# EAGLE design singleboard (EAGLE 7.2.0)
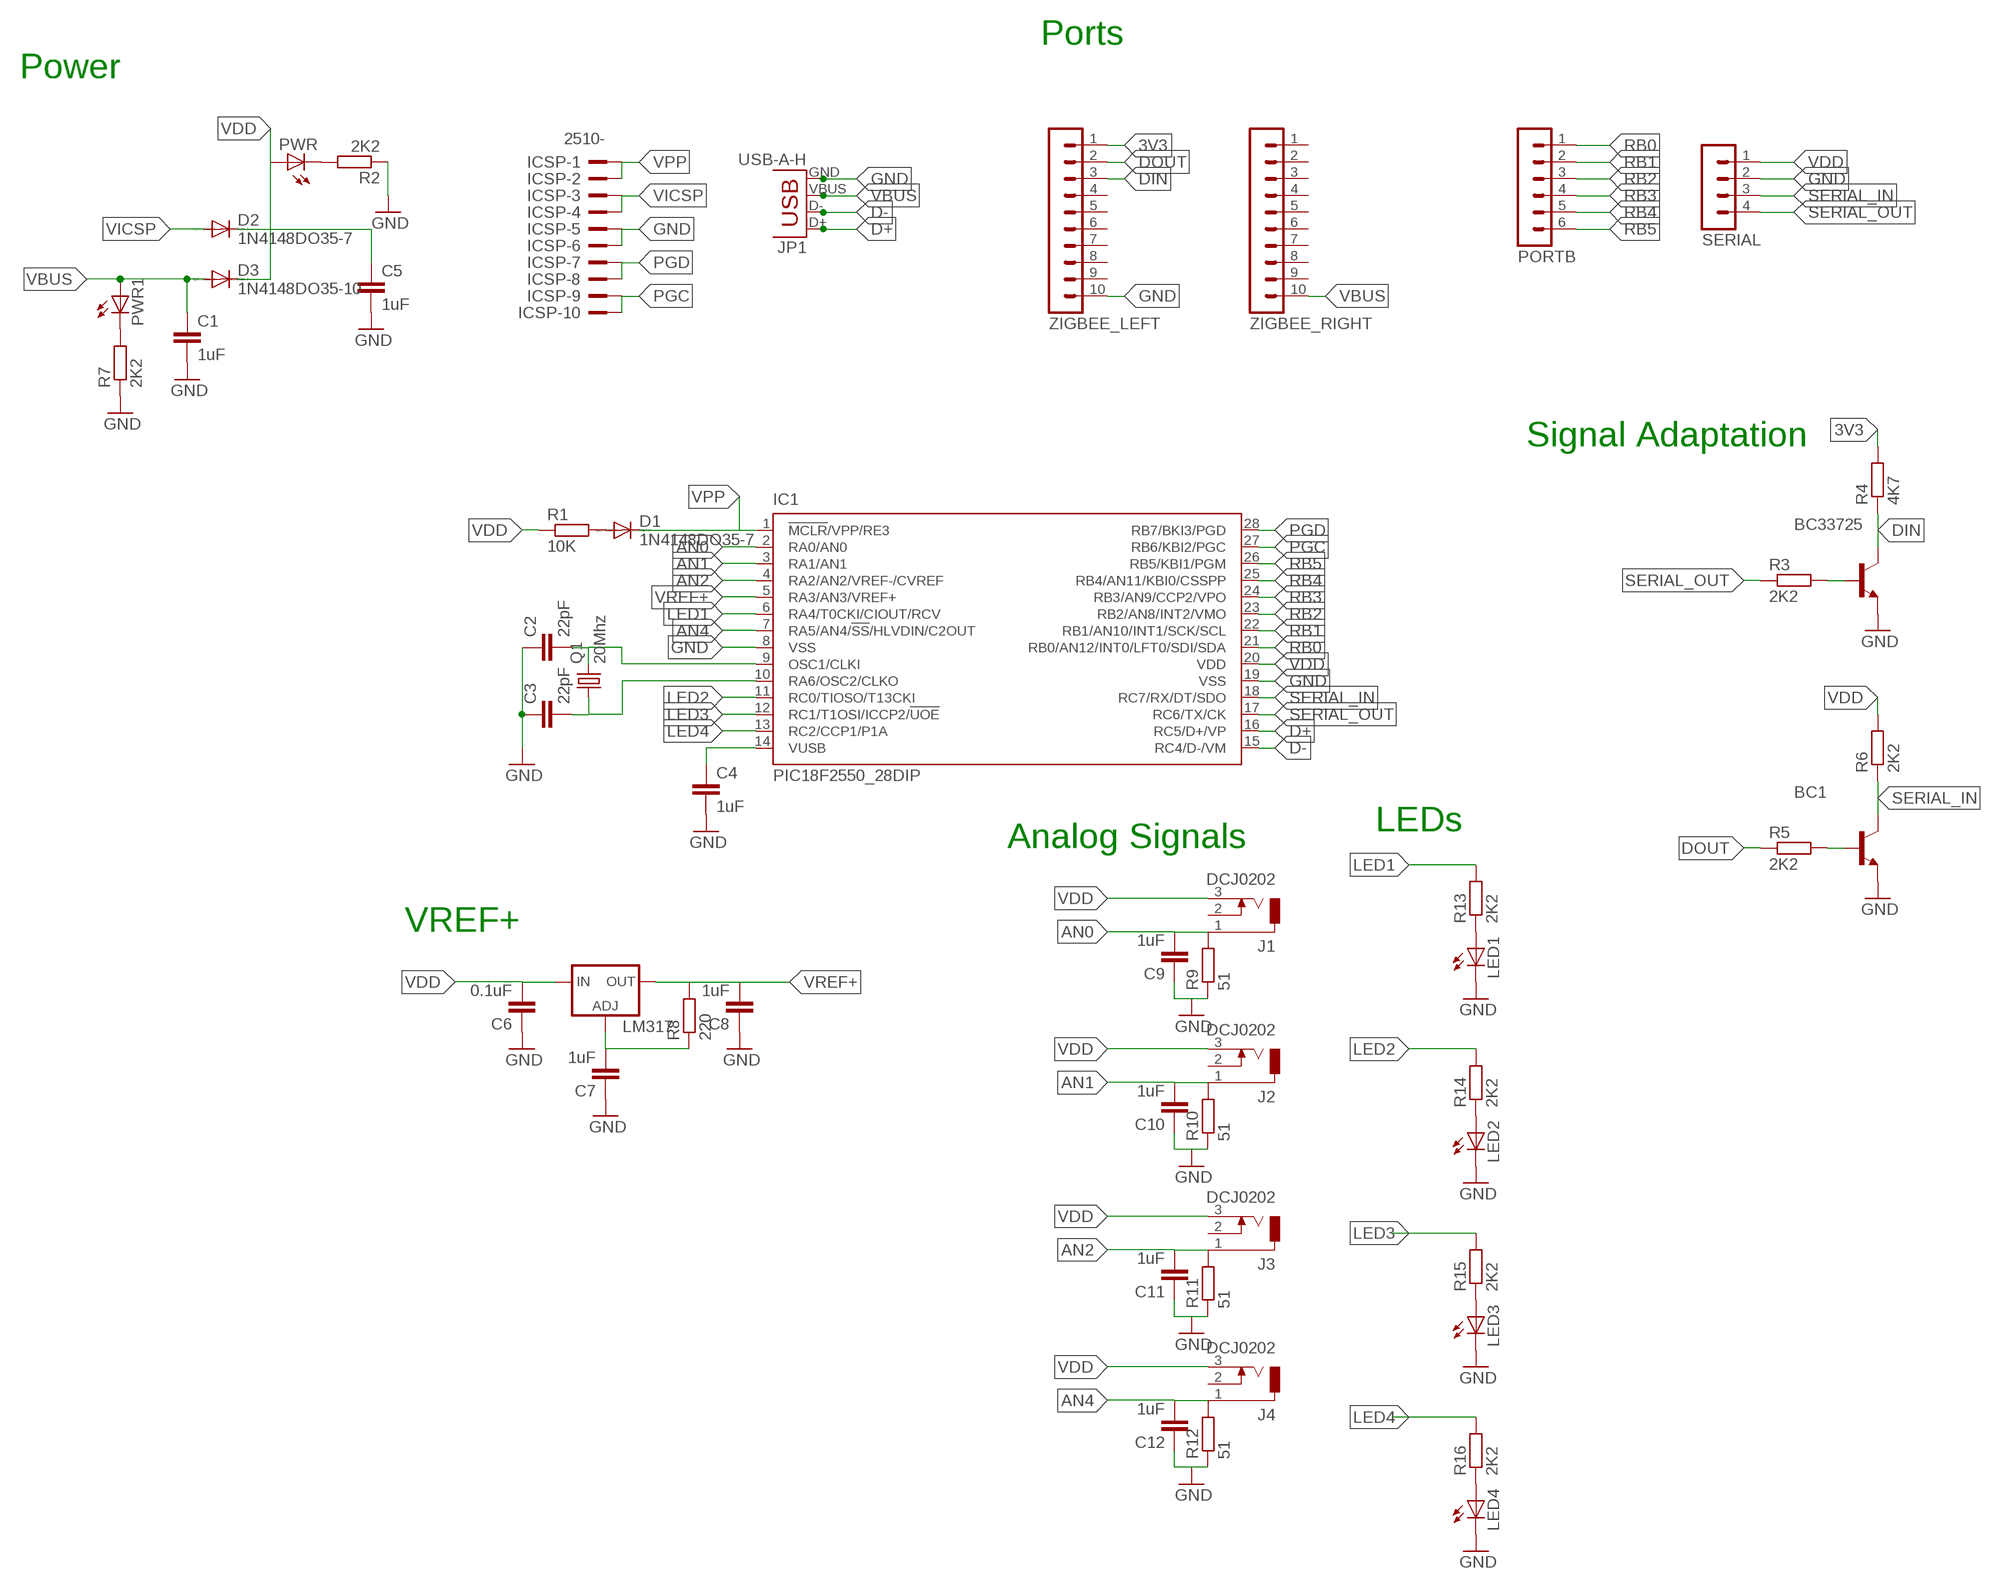
[diagram p0: schematic, sheet 1]

## Parts
BC1  BC337-25-NPN-TO92-CBE  [TO92-CBE]
BC33725  BC337-25-NPN-TO92-CBE  [TO92-CBE]
C1  1uF  C-EU050-025X075  [C050-025X075]
C2  22pF  C-EU025-024X044  [C025-024X044]
C3  22pF  C-EU025-024X044  [C025-024X044]
C4  1uF  C-EU025-024X044  [C025-024X044]
C5  1uF  C-EU025-024X044  [C025-024X044]
C6  0.1uF  C-EU050-025X075  [C050-025X075]
C7  1uF  C-EU050-025X075  [C050-025X075]
C8  1uF  C-EU050-025X075  [C050-025X075]
C9  1uF  C-EU050-025X075  [C050-025X075]
C10  1uF  C-EU050-025X075  [C050-025X075]
C11  1uF  C-EU050-025X075  [C050-025X075]
C12  1uF  C-EU050-025X075  [C050-025X075]
D1  1N4148DO35-7  [DO35-7]
D2  1N4148DO35-7  [DO35-7]
D3  1N4148DO35-10  [DO35-10]
IC1  PIC18F2550_28DIP  [DIL28-3]
ICSP  2510-  [PAK100/2500-10]
J1  DCJ0202  [DCJ0202]
J2  DCJ0202  [DCJ0202]
J3  DCJ0202  [DCJ0202]
J4  DCJ0202  [DCJ0202]
JP1  USB-A-H  [USB-A-H]
LED1  LED3MM  [LED3MM]
LED2  LED3MM  [LED3MM]
LED3  LED3MM  [LED3MM]
LED4  LED3MM  [LED3MM]
LM317  LM317TS  [317TS]
PORTB  MA06-1  [MA06-1]
PWR  LED3MM  [LED3MM]
PWR1  LED3MM  [LED3MM]
Q1  20Mhz  CRYSTALHC49S  [HC49/S]
R1  10K  R-EU_0204/7  [0204/7]
R2  2K2  R-EU_0204/5  [0204/5]
R3  2K2  R-EU_0204/5  [0204/5]
R4  4K7  R-EU_0204/5  [0204/5]
R5  2K2  R-EU_0204/5  [0204/5]
R6  2K2  R-EU_0204/5  [0204/5]
R7  2K2  R-EU_0204/5  [0204/5]
R8  220  R-EU_0204/5  [0204/5]
R9  51  R-EU_0204/5  [0204/5]
R10  51  R-EU_0204/5  [0204/5]
R11  51  R-EU_0204/5  [0204/5]
R12  51  R-EU_0204/5  [0204/5]
R13  2K2  R-EU_0204/5  [0204/5]
R14  2K2  R-EU_0204/5  [0204/5]
R15  2K2  R-EU_0204/5  [0204/5]
R16  2K2  R-EU_0204/5  [0204/5]
SERIAL  MA04-1  [MA04-1]
ZIGBEE_LEFT  MA10-1  [MA10-1]
ZIGBEE_RIGHT  MA10-1  [MA10-1]

## Nets
3V3: R4.2 ZIGBEE_LEFT.1
AN0: C9.2 IC1.2(RA0/AN0) J1.1 R9.2
AN1: C10.2 IC1.3(RA1/AN1) J2.1 R10.2
AN2: C11.2 IC1.4(RA2/AN2/VREF-/CVREF) J3.1 R11.2
AN4: C12.2 IC1.7(RA5/AN4/!SS!/HLVDIN/C2OUT) J4.1 R12.2
D+: IC1.16(RC5/D+/VP) JP1.D+
D-: IC1.15(RC4/D-/VM) JP1.D-
DIN: BC33725.C R4.1 ZIGBEE_LEFT.3
DOUT: R5.1 ZIGBEE_LEFT.2
GND: BC1.E BC33725.E C1.2 C2.1 C3.1 C4.2 C5.2 C6.1 C7.1 C8.1 C9.1 C10.1 C11.1 C12.1 IC1.8(VSS) IC1.19(VSS) ICSP.5 ICSP.6 JP1.GND LED1.K(C) LED2.K(C) LED3.K(C) LED4.K(C) R2.1 R7.1 R9.1 R10.1 R11.1 R12.1 SERIAL.2 ZIGBEE_LEFT.10
LED1: IC1.6(RA4/T0CKI/CIOUT/RCV) R13.2
LED2: IC1.11(RC0/TIOSO/T13CKI) R14.2
LED3: IC1.12(RC1/T1OSI/ICCP2/!UOE) R15.2
LED4: IC1.13(RC2/CCP1/P1A) R16.2
N$1: C3.2 IC1.10(RA6/OSC2/CLKO) Q1.1
N$2: D1.A R1.2
N$3: C4.1 IC1.14(VUSB)
N$4: C2.2 IC1.9(OSC1/CLKI) Q1.2
N$5: PWR.K(C) R2.2
N$6: BC33725.B R3.2
N$7: BC1.B R5.2
N$8: PWR1.K(C) R7.2
N$9: C7.2 LM317.1(ADJ) R8.1
N$10: LED1.A R13.1
N$11: LED2.A R14.1
N$12: LED3.A R15.1
N$13: LED4.A R16.1
PGC: IC1.27(RB6/KBI2/PGC) ICSP.9 ICSP.10
PGD: IC1.28(RB7/BKI3/PGD) ICSP.7 ICSP.8
RB0: IC1.21(RB0/AN12/INT0/LFT0/SDI/SDA) PORTB.1
RB1: IC1.22(RB1/AN10/INT1/SCK/SCL) PORTB.2
RB2: IC1.23(RB2/AN8/INT2/VMO) PORTB.3
RB3: IC1.24(RB3/AN9/CCP2/VPO) PORTB.4
RB4: IC1.25(RB4/AN11/KBI0/CSSPP) PORTB.5
RB5: IC1.26(RB5/KBI1/PGM) PORTB.6
SERIAL_IN: BC1.C IC1.18(RC7/RX/DT/SDO) R6.1 SERIAL.3
SERIAL_OUT: IC1.17(RC6/TX/CK) R3.1 SERIAL.4
VBUS: C1.1 D3.A JP1.VBUS PWR1.A ZIGBEE_RIGHT.10
VDD: C5.1 C6.2 D2.C D3.C IC1.20(VDD) J1.3 J2.3 J3.3 J4.3 LM317.3(IN) PWR.A R1.1 R6.2 SERIAL.1
VICSP: D2.A ICSP.3 ICSP.4
VPP: D1.C IC1.1(!MCLR!/VPP/RE3) ICSP.1 ICSP.2
VREF+: C8.2 IC1.5(RA3/AN3/VREF+) LM317.2(OUT) R8.2
Unconnected: J1.2 J2.2 J3.2 J4.2 ZIGBEE_LEFT.4 ZIGBEE_LEFT.5 ZIGBEE_LEFT.6 ZIGBEE_LEFT.7 ZIGBEE_LEFT.8 ZIGBEE_LEFT.9 ZIGBEE_RIGHT.1 ZIGBEE_RIGHT.2 ZIGBEE_RIGHT.3 ZIGBEE_RIGHT.4 ZIGBEE_RIGHT.5 ZIGBEE_RIGHT.6 ZIGBEE_RIGHT.7 ZIGBEE_RIGHT.8 ZIGBEE_RIGHT.9

## Notes on the sheet
- Ports
- Power
- Signal Adaptation
- LEDs
- Analog Signals
- VREF+

## Library data of the parts
BC1 BC33725 = transistor:*-NPN-: NPN Transistror BF959 corrected 2008.03.06
C1-C12 = rcl:C-EU: CAPACITOR, European symbol
D1-D3 = diode:1N4148: DIODE high speed (Philips)
IC1 = microchip:PIC18F2*_28: USB Microcontrollers with nanoWatt Technology High-Performance, Enhanced Flash, 28/40/44-Pin, Source: http://ww1.microchip.com/downloads/en/devicedoc/39632c.pdf; MF: MICROCHIP; MPN: PIC18F2550-I/SP; OC_FARNELL: 1523822; OC_NEWARK: 80K6054
ICSP = con-3m:2510-: 3M (TM) Pak 100 4-Wall Header Source: 3M; MF: 3M; MPN: 2510-6002UB; OC_FARNELL: 9838244; OC_NEWARK: 46F4725
J1-J4 = con-jack:DCJ0202: DC POWER JACK Source: DCJ0202.pdf; OC_FARNELL: unknown; OC_NEWARK: unknown
JP1 = SparkFun-Connectors:USB: USB Connectors USB-B-PTH is fully proven SKU : PRT-00139/CONN-08278 USB-miniB is fully proven SKU : PRT-00587 USB-A-PCB is untested. USB-A-H is throughly reviewed, but untested. Spark Fun Electronics SKU : PRT-00437 USB-B-SMT is throughly reviewed, but untested. Needs silkscreen touching up. USB-A-S has not been used/tested USB-MB-H has not been used/tested USB-MICROB has been used. CONN-09505; PROD_ID: CONN-08367
LED1-LED4 PWR PWR1 = led:LED: LED OSRAM: - CHIPLED LG R971, LG N971, LY N971, LG Q971, LY Q971, LO R971, LY R971 LH N974, LH R974 LS Q976, LO Q976, LY Q976 LO Q996 - Hyper CHIPLED LW Q18S LB Q993, LB Q99A, LB R99A - SideLED LS A670, LO A670, LY A670, LG A670, LP A670 LB A673, LV A673, LT A673, LW A673 LH A674 LY A675 LS A676, LA A676, LO A676, LY A676, LW A676 LS A679, LY A679, LG A679 - Hyper Micro SIDELED® LS Y876, LA Y876, LO Y876, LY Y876 LT Y87S - SmartLED LW L88C, LW L88S LB L89C, LB L89S, LG L890 LS L89K, LO L89K, LY L89K LS L896, LA L896, LO L896, LY L896 - TOPLED LS T670, LO T670, LY T670, LG T670, LP T670 LSG T670, LSP T670, LSY T670, LOP T670, LYG T670 LG T671, LOG T671, LSG T671 LB T673, LV T673, LT T673, LW T673 LH T674 LS T676, LA T676, LO T676, LY T676, LB T676, LH T676, LSB T676, LW T676 LB T67C, LV T67C, LT T67C, LS T67K, LO T67K, LY T67K, LW E67C LS E67B, LA E67B, LO E67B, LY E67B, LB E67C, LV E67C, LT E67C LW T67C LS T679, LY T679, LG T679 LS T770, LO T770, LY T770, LG T770, LP T770 LB T773, LV T773, LT T773, LW T773 LH T774 LS E675, LA E675, LY E675, LS T675 LS T776, LA T776, LO T776, LY T776, LB T776 LHGB T686 LT T68C, LB T68C - Hyper Mini TOPLED® LB M676 - Mini TOPLED Santana® LG M470 LS M47K, LO M47K, LY M47K Source: http://www.osram.convergy.de LUXEON: - LUMILED® LXK2-PW12-R00, LXK2-PW12-S00, LXK2-PW14-U00, LXK2-PW14-V00 LXK2-PM12-R00, LXK2-PM12-S00, LXK2-PM14-U00 LXK2-PE12-Q00, LXK2-PE12-R00, LXK2-PE12-S00, LXK2-PE14-T00, LXK2-PE14-U00 LXK2-PB12-K00, LXK2-PB12-L00, LXK2-PB12-M00, LXK2-PB14-N00, LXK2-PB14-P00, LXK2-PB14-Q00 LXK2-PR12-L00, LXK2-PR12-M00, LXK2-PR14-Q00, LXK2-PR14-R00 LXK2-PD12-Q00, LXK2-PD12-R00, LXK2-PD12-S00 LXK2-PH12-R00, LXK2-PH12-S00 LXK2-PL12-P00, LXK2-PL12-Q00, LXK2-PL12-R00 Source: www.luxeon.com KINGBRIGHT: KA-3528ASYC Source: www.kingbright.com
LM317 = v-reg:LM317TS: VOLTAGE REGULATOR
PORTB = con-lstb:MA06-1: PIN HEADER; OC_FARNELL: unknown; OC_NEWARK: unknown
Q1 = crystal:CRYSTAL: CRYSTAL; OC_FARNELL: 1667008; OC_NEWARK: unknown
R1 = resistor:R-EU_: RESISTOR, European symbol
R2-R16 = rcl:R-EU_: RESISTOR, European symbol
SERIAL = con-lstb:MA04-1: PIN HEADER; OC_FARNELL: unknown; OC_NEWARK: unknown
ZIGBEE_LEFT ZIGBEE_RIGHT = con-lstb:MA10-1: PIN HEADER; OC_FARNELL: unknown; OC_NEWARK: unknown

## Board
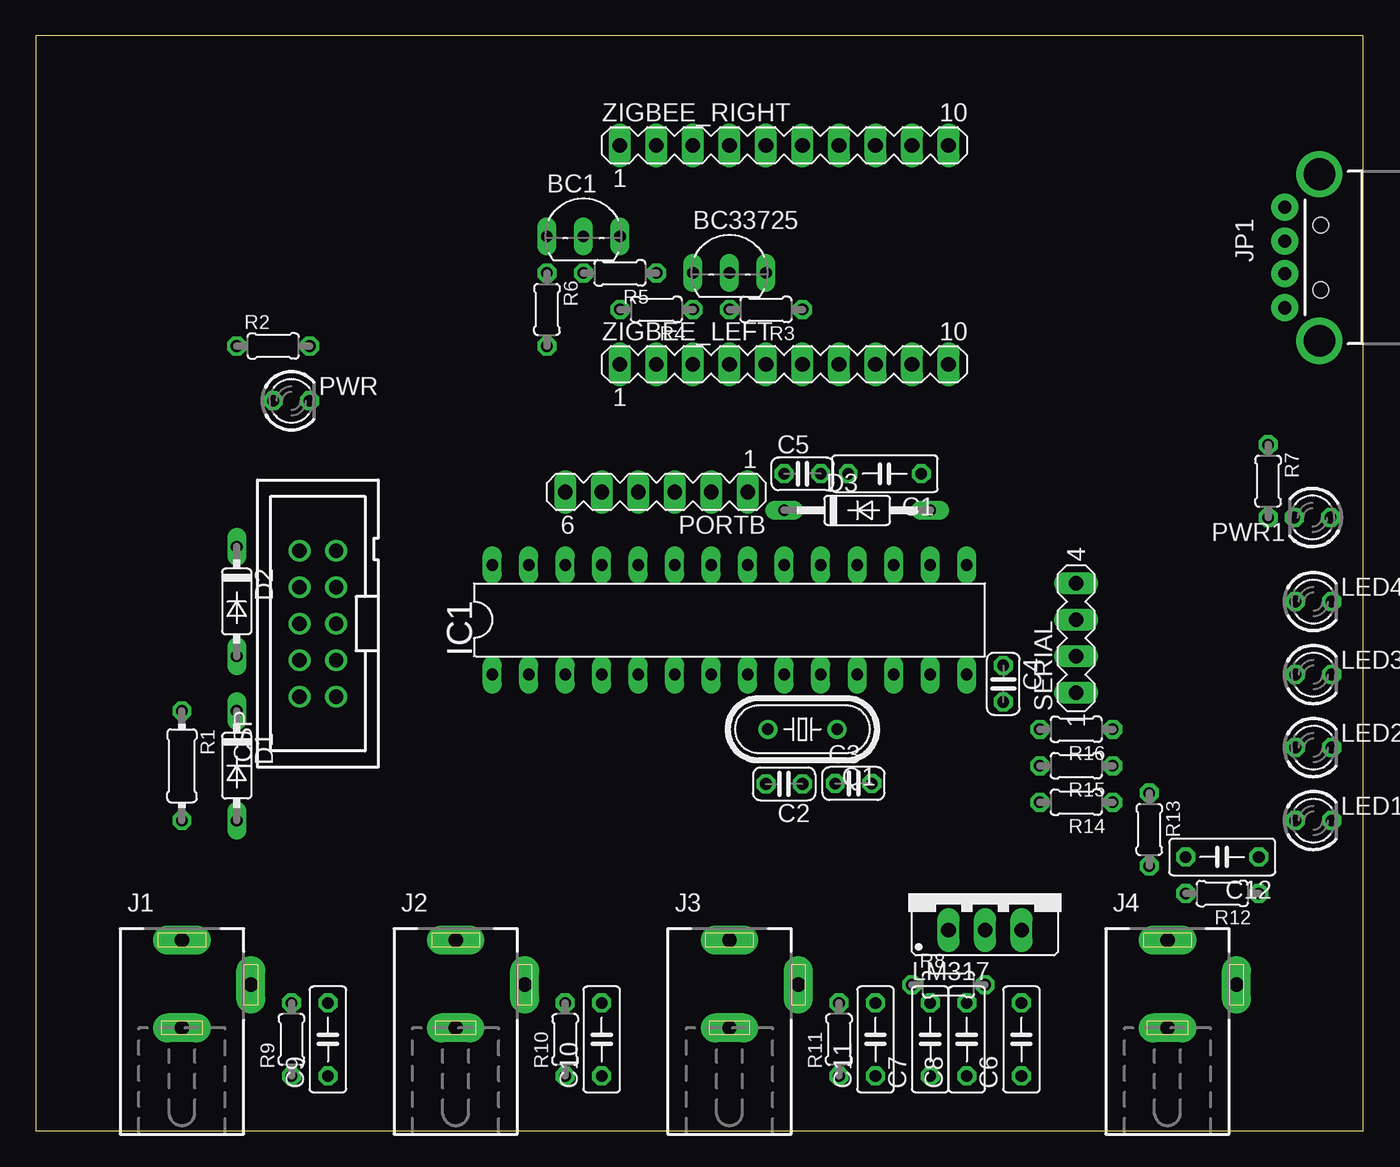
[diagram p1: board, top side]
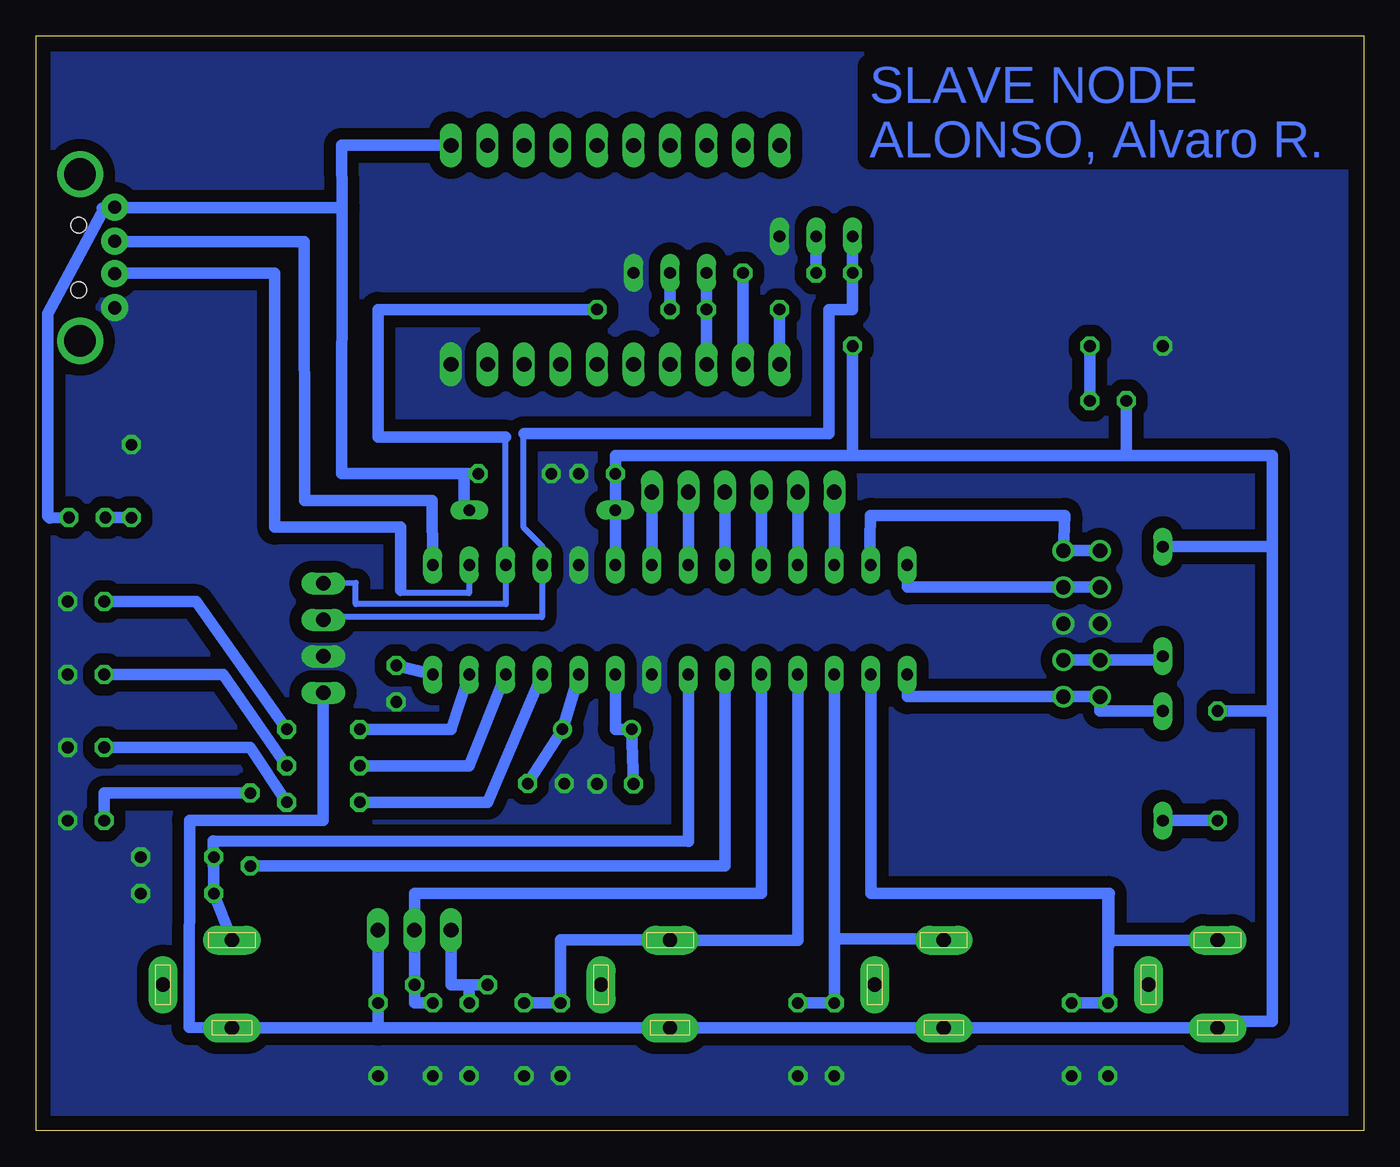
[diagram p2: board, bottom side, seen from below]

Size 92.38 x 76.19 mm. Coordinates in mm from the lower left corner, seen from the top.
Outline: 0,0 92.38,0 92.38,76.19 0,76.19 0,0
Copper layers (1*16): Top 0.035mm / dielectric 1.5mm / Bottom 0.035mm
Design rules "default": minimum track width 10mil, minimum drill 24mil, track to track 8mil, track to pad 8mil, pad to pad 8mil, via to via 8mil, smd to smd 8mil, copper to edge 40mil, drill to drill 8mil, minimum pad ring 10mil, minimum via ring 8mil, stop-mask expansion 4mil, vias tented up to drill 0mil, thermal gap 10mil

### Footprints (pad centres in the part's own frame; a part is rotated, then mirrored left to right if it is on the bottom)
TO92-CBE = drill 0.813 long: B 0,0; C -2.54,0; E 2.54,0
C050-025X075 = drill 0.813 octagon: 1 -2.54,0; 2 2.54,0
C025-024X044 = drill 0.813 octagon: 1 -1.27,0; 2 1.27,0
DO35-7 = drill 0.813 long: A 3.81,0; C -3.81,0
DO35-10 = drill 0.813 long: A 5.08,0; C -5.08,0
DIL28-3 = drill 0.813 long: 1 -16.51,-3.81; 2 -13.97,-3.81; 3 -11.43,-3.81; 4 -8.89,-3.81; 5 -6.35,-3.81; 6 -3.81,-3.81; 7 -1.27,-3.81; 8 1.27,-3.81; 9 3.81,-3.81; 10 6.35,-3.81; 11 8.89,-3.81; 12 11.43,-3.81; 13 13.97,-3.81; 14 16.51,-3.81; 15 16.51,3.81; 16 13.97,3.81; 17 11.43,3.81; 18 8.89,3.81; 19 6.35,3.81; 20 3.81,3.81; 21 1.27,3.81; 22 -1.27,3.81; 23 -3.81,3.81; 24 -6.35,3.81; 25 -8.89,3.81; 26 -11.43,3.81; 27 -13.97,3.81; 28 -16.51,3.81
PAK100/2500-10 = drill 1 pad 1.422: 1 -5.08,-1.27; 2 -5.08,1.27; 3 -2.54,-1.27; 4 -2.54,1.27; 5 0,-1.27; 6 0,1.27; 7 2.54,-1.27; 8 2.54,1.27; 9 5.08,-1.27; 10 5.08,1.27
DCJ0202 = drill 1 pad 2 long: 1 0,3.1; 2 4.8,0; 3 0,-3
USB-A-H = drill 0.914 pad 1.88: D+ 2.4,1.127; D- 2.4,-1.127; GND 2.4,3.5; VBUS 2.4,-3.5 | drill 2.2: GND2 0,-5.8; GND3 0,5.8 | hole 1.1: -0.1,2.25; -0.1,-2.25
LED3MM = drill 0.813 octagon: A -1.27,0; K 1.27,0
317TS = drill 1.016 long: 1 -2.54,-2.54; 2 0,-2.54; 3 2.54,-2.54
MA06-1 = drill 1.016 long: 1 -6.35,0; 2 -3.81,0; 3 -1.27,0; 4 1.27,0; 5 3.81,0; 6 6.35,0
HC49/S = drill 0.813: 1 -2.413,0; 2 2.413,0
0204/7 = drill 0.813 octagon: 1 -3.81,0; 2 3.81,0
0204/5 = drill 0.813 octagon: 1 -2.54,0; 2 2.54,0
MA04-1 = drill 1.016 long: 1 -3.81,0; 2 -1.27,0; 3 1.27,0; 4 3.81,0
MA10-1 = drill 1.016 long: 1 -11.43,0; 2 -8.89,0; 3 -6.35,0; 4 -3.81,0; 5 -1.27,0; 6 1.27,0; 7 3.81,0; 8 6.35,0; 9 8.89,0; 10 11.43,0

### Placement (x,y rotation side)
BC1  38.1,62.23 0 top
BC33725  48.26,59.69 0 top
C1  59.06,45.72 180 top
C2  52.07,24.13 180 top
C3  56.89,24.16 0 top
C4  67.31,31.11 270 top
C5  53.34,45.72 0 top
C6  68.58,6.35 90 top
C7  62.23,6.35 90 top
C8  64.77,6.35 90 top
C9  20.32,6.35 90 top
C10  39.37,6.35 90 top
C11  58.42,6.35 90 top
C12  82.55,19.05 180 top
D1  13.97,25.4 270 top
D2  13.97,36.83 270 top
D3  57.15,43.18 0 top
IC1  48.26,35.56 0 top
ICSP  19.62,35.29 90 top
J1  10.16,10.16 0 top
J2  29.21,10.16 0 top
J3  48.26,10.16 0 top
J4  78.74,10.16 0 top
JP1  89.31,60.77 180 top
LED1  88.9,21.59 0 top
LED2  88.9,26.67 0 top
LED3  88.9,31.75 0 top
LED4  88.9,36.83 0 top
LM317  66.04,16.51 0 top
PORTB  43.18,44.45 180 top
PWR  17.78,50.8 0 top
PWR1  88.82,42.67 180 top
Q1  53.34,27.94 180 top
R1  10.16,25.4 270 top
R2  16.51,54.61 0 top
R3  50.8,57.15 180 top
R4  43.18,57.15 180 top
R5  40.64,59.69 180 top
R6  35.56,57.15 270 top
R7  85.74,45.21 270 top
R8  63.5,10.16 0 top
R9  17.78,6.35 90 top
R10  36.83,6.35 90 top
R11  55.88,6.35 90 top
R12  82.55,16.51 180 top
R13  77.47,20.96 270 top
R14  72.39,22.86 180 top
R15  72.39,25.4 180 top
R16  72.39,27.94 180 top
SERIAL  72.39,34.29 90 top
ZIGBEE_LEFT  52.07,53.34 0 top
ZIGBEE_RIGHT  52.07,68.58 0 top

### Tracks (layer width: path | path; a pad name or v marks a point on that pad's centre or on a via)
3V3
  Bottom 0.813: ZIGBEE_LEFT.1 R4.2
AN0
  Bottom 0.813: 10.25,13.18 J1.1 17.74,13.26 | IC1.2 34.29,16.51 17.78,16.51 | C9.2 R9.2 17.78,16.51 | 17.74,16.51 17.78,16.51 | 17.7,16.51 17.74,16.51 | 17.74,16.51 17.74,13.26 | 17.74,13.26 17.74,12.91
AN1
  Bottom 0.813: J2.1 29.21,13.35 36.83,13.35 | C10.2 R10.2 36.83,13.35 | IC1.3 36.83,13.35
AN2
  Bottom 0.813: IC1.4 39.37,13.26 J3.1 | J3.1 48.26,13.28 55.88,13.28 R11.2 C11.2 | J3.1
AN4
  Bottom 0.813: IC1.7 46.99,20.15 80.07,20.17 R12.2 | R12.2 J4.1 | C12.2 R12.2
D+
  Bottom 0.406: IC1.16 62.26,39.41 62.26,37.41 67.01,37.41 66.99,37.62
  Bottom 0.813: 66.99,37.62 66.99,42.01 75.77,42.01 75.77,59.67 86.88,59.67 JP1.D+
D-
  Bottom 0.813: IC1.15 64.81,43.87 73.7,43.87 73.71,61.86 86.58,61.88 JP1.D-
DIN
  Bottom 0.813: ZIGBEE_LEFT.3 R4.1 BC33725.C
DOUT
  Bottom 0.813: ZIGBEE_LEFT.2 R5.1
GND
  pour Bottom (isolate 0.813, no thermals): 1.27,0 92.71,0 92.71,74.93 1.27,74.93
LED1
  Bottom 0.813: IC1.6 44.45,18.42 R13.2
LED2
  Bottom 0.813: IC1.11 60.96,22.86 R14.2
LED3
  Bottom 0.813: IC1.12 62.23,25.4 R15.2
LED4
  Bottom 0.813: IC1.13 63.5,27.94 R16.2
N$1
  Bottom 0.813: IC1.10 Q1.1 C3.2
N$2
  Bottom 0.813: D1.A R1.2
N$3
  Bottom 0.813: IC1.14 C4.1
N$4
  Bottom 0.813: IC1.9 52.07,27.94 Q1.2 C2.2
N$5
  Bottom 0.813: PWR.K R2.2
N$6
  Bottom 0.813: BC33725.B R3.2
N$7
  Bottom 0.813: R5.2 BC1.B
N$8
  Bottom 0.813: R7.2 PWR1.K
N$9
  Bottom 0.813: LM317.1 63.5,10.16 62.23,10.16 | 62.23,10.16 R8.1 | C7.2 62.23,10.16
N$10
  Bottom 0.813: LED1.A 87.63,23.5 R13.1
N$11
  Bottom 0.813: R14.1 77.47,26.67 LED2.A
N$12
  Bottom 0.813: R15.1 79.37,31.75 LED3.A
N$13
  Bottom 0.813: R16.1 81.25,36.81 LED4.A
PGC
  Bottom 0.813: ICSP.10 ICSP.9 20.8,42.82 34.3,42.82 34.39,39.37 IC1.27
PGD
  Bottom 0.813: ICSP.8 ICSP.7 31.75,37.83 IC1.28
RB0
  Bottom 0.813: IC1.21 PORTB.1
RB1
  Bottom 0.813: IC1.22 PORTB.2
RB2
  Bottom 0.813: IC1.23 PORTB.3
RB3
  Bottom 0.813: IC1.24 PORTB.4
RB4
  Bottom 0.813: IC1.25 PORTB.5
RB5
  Bottom 0.813: IC1.26 PORTB.6
SERIAL_IN
  Bottom 0.406: SERIAL.3 72.39,35.74 57.17,35.74 57.17,39.37 IC1.18 57.15,40.68 58.44,41.97 58.44,48.49 58.42,48.51
  Bottom 0.813: 58.42,48.51 37.19,48.51 37.19,57.15 35.56,57.15 R6.1 BC1.C
SERIAL_OUT
  Bottom 0.406: SERIAL.4 72.36,38.05 70.13,38.12 70.13,36.64 59.7,36.64 IC1.17 59.69,48.26
  Bottom 0.813: 59.69,48.26 68.58,48.26 68.58,57.15 R3.1
VBUS
  Bottom 0.813: C1.1 62.6,45.72 | 62.6,45.72 71.12,45.72 71.07,64.25 | 71.07,64.25 71.12,68.58 ZIGBEE_RIGHT.10 | 71.07,64.25 87.58,64.25 | 87.58,64.25 91.57,56.85 91.57,42.79 91.44,42.65 PWR1.A | D3.A 62.6,43.18 62.6,45.72 | JP1.VBUS 87.77,64.2 87.58,64.25
VDD
  Bottom 0.813: IC1.20 D3.C C5.1 52.07,46.99 35.56,46.99 | 35.56,46.99 16.51,46.99 | 16.51,46.99 PWR.A | R6.2 35.56,46.99 | 6.35,40.64 6.35,46.99 16.51,46.99 | 6.35,40.64 6.35,29.21 | 6.35,29.21 6.35,7.62 10.16,7.62 J1.3 J2.3 J3.3 68.58,7.16 | LM317.3 C6.2 68.58,7.16 | 68.58,7.16 J4.3 81.73,7.2 81.7,21.6 72.39,21.59 SERIAL.1 | D2.C 6.35,40.64 | R1.1 6.35,29.21
VICSP
  Bottom 0.813: ICSP.3 ICSP.4 13.97,32.75 D2.A
VPP
  Bottom 0.813: IC1.1 31.75,30.21 ICSP.1 ICSP.2 18.35,29.21 D1.C
VREF+
  Bottom 0.813: IC1.5 41.91,16.51 66.04,16.51 LM317.2 R8.2 66.04,8.89 C8.2

### Text on the board
Bottom: SLAVE NODE / ALONSO, Alvaro R.